# Altium project Internship_2.PrjPcb
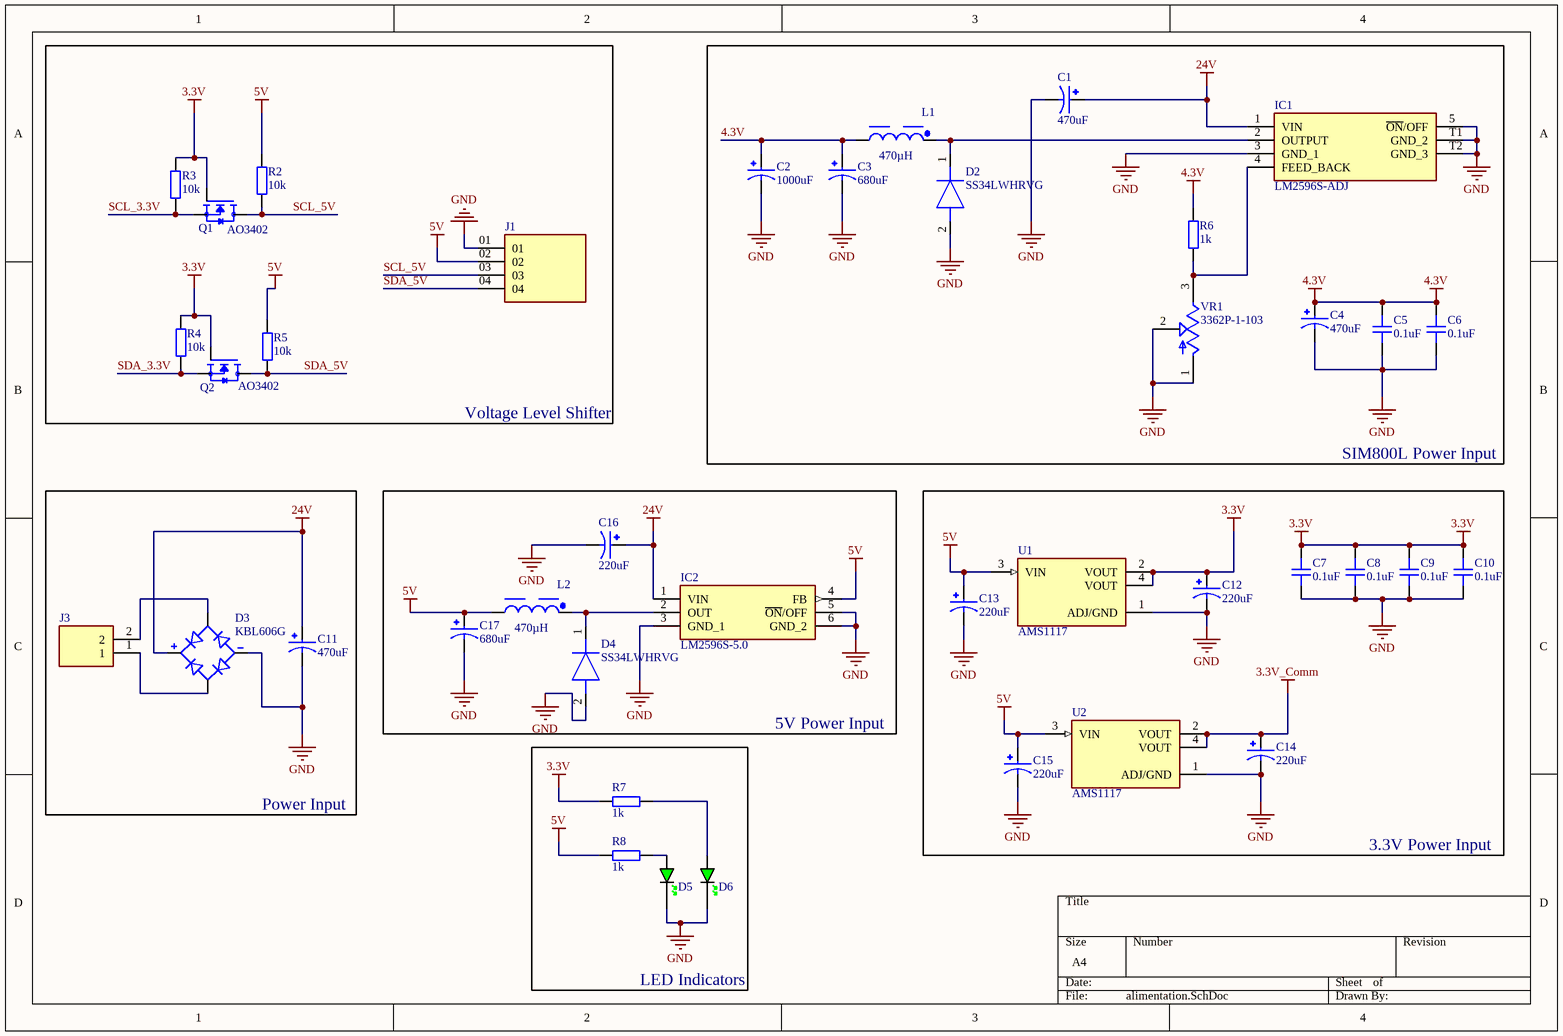
[diagram p0: alimentation.SchDoc]
2 sheets, 84 parts. Net scope: global (net labels, ports and power ports of the same name join across sheets).
Board file: PCB1.PcbDoc
Sheets:
  alimentation.SchDoc
  communication.SchDoc

## Sheet alimentation.SchDoc
size A4; SheetNumber: 1; SheetTotal: 2

### Parts
C1  470uF  [CAPPRD500W60D1000H1600]
C2  1000uF  [CAPPRD500W60D1000H2500]
C3  680uF  [CAPPRD500W60D1000H1600]
C4  470uF  [CAPPRD500W60D1000H1600]
C5  0.1uF  [CAP_0805]
C6  0.1uF  [CAP_0805]
C7  0.1uF  [CAP_0805]
C8  0.1uF  [CAP_0805]
C9  0.1uF  [CAP_0805]
C10  0.1uF  [CAP_0805]
C11  470uF  [CAPPRD500W60D1000H1600]
C12  220uF  [CAPPRD500W60D800H1150]
C13  220uF  [CAPPRD500W60D800H1150]
C14  220uF  [CAPPRD500W60D800H1150]
C15  220uF  [CAPPRD500W60D800H1150]
C16  220uF  [CAPPRD500W60D800H1150]
C17  680uF  [CAPPRD500W60D1000H1600]
D2  SS34LWHRVG  [SODFL3718X102N]
D3  KBL606G  [SIP600W130P510L1900H1630Q4]
D4  SS34LWHRVG  [SODFL3718X102N]
D5  GREEN  [LED_0805_GREEN]  (value not drawn)
D6  GREEN  [LED_0805_GREEN]  (value not drawn)
IC1  LM2596S-ADJ  [LM2596SXADJ]
IC2  LM2596S-5.0  [KTT0005B]
J1  MTSW-104-08-S-S-270  [SAMTEC_MTSW-104-08-S-S-270]  (value not drawn)
J3  TBP04R12-500-02BE  [CUI_TBP04R12-500-02BE]  (value not drawn)
L1  470µH  [WE-PD HV_1210]
L2  470µH  [WE-PD HV_1210]
Q1  AO3402  [SOT95P280X125-3N]
Q2  AO3402  [SOT95P280X125-3N]
R2  10k  [RES_1206]
R3  10k  [RES_1206]
R4  10k  [RES_1206]
R5  10k  [RES_1206]
R6  1k  [RES_1206]
R7  1k  [RES_1206]
R8  1k  [RES_1206]
U1  AMS1117  [SOT229P700X180-4N]
U2  AMS1117  [SOT229P700X180-4N]
VR1  3362P-1-103  [TRIM_3362P-1-103]

### Blocks framed on the sheet
Voltage Level Shifter: J1 Q1 Q2 R2-R5
SIM800L Power Input: C1-C6 D2 IC1 L1 R6 VR1
Power Input: C11 D3 J3
5V Power Input: C16 C17 D4 IC2 L2
3.3V Power Input: C7-C10 C12-C15 U1 U2
LED Indicators: D5 D6 R7 R8

### Nets
3.3V: C7.2 C8.2 C9.2 C10.2 C12.P Q1.1(G) Q2.1(G) R3.1 R4.1 R7.1 U1.2(VOUT) U1.4(VOUT)
3.3V_Comm: C14.P U2.2(VOUT) U2.4(VOUT)
4.3V: C2.P C3.P C4.P C5.2 C6.2 L1.2 R6.2
5V: C13.P C15.P C17.P IC2.4(FB) J1.02 L2.2 R2.1 R5.1 R8.1 U1.3(VIN) U2.3(VIN)
24V: C1.P C11.P C16.P D3.POS IC1.1(VIN) IC2.1(VIN)
GND: C1.N C2.N C3.N C4.N C5.1 C6.1 C7.1 C8.1 C9.1 C10.1 C11.N C12.N C13.N C14.N C15.N C16.N C17.N D2.2(A) D3.NEG D4.2(A) D5.K D6.K IC1.3(GND_1) IC1.5(~{ON}/OFF) IC1.T1(GND_2) IC1.T2(GND_3) IC2.3(GND_1) IC2.5(~{ON}/OFF) IC2.6(GND_2) J1.01 U1.1(ADJ/GND) U2.1(ADJ/GND) VR1.1(CCW) VR1.2(WIPER)
SCL_3.3V: Q1.2(S) R3.2
SCL_5V: J1.03 Q1.3(D) R2.2
SDA_3.3V: Q2.2(S) R4.2
SDA_5V: J1.04 Q2.3(D) R5.2
NetD2_1: D2.1(K) IC1.2(OUTPUT) L1.1
NetD3_AC1: D3.AC1 J3.2
NetD3_AC2: D3.AC2 J3.1
NetD4_1: D4.1(K) IC2.2(OUT) L2.1
NetD5_A: D5.A R8.2
NetD6_A: D6.A R7.2
NetIC1_4: IC1.4(FEED_BACK) R6.1 VR1.3(CW)

### Library data of the parts
C1 C3 C4 C11 C17 = EEUHD1V681B: CAP ALUM 680UF 20% 35V RADIAL; MF: Panasonic; MP: EEU-HD1V681B; Package: RADIAL-2 Panasonic; Price: None; Check_prices: https://www.snapeda.com/parts/EEU-HD1V681B/Panasonic/view-part/?ref=eda; Value: *; SnapEDA_Link: https://www.snapeda.com/parts/EEU-HD1V681B/Panasonic/view-part/?ref=snap; Availability: In Stock; Purchase-URL: https://pricing.snapeda.com/search?q=EEU-HD1V681B&ref=eda
C2 = EEUFS1V102L: 1000ÂµF 35V Aluminum Electrolytic Capacitors Radial, Can 10000 Hrs @ 105Â°C; MF: Panasonic; Package: RADIAL-2 Panasonic; SnapEDA_Link: https://www.snapeda.com/parts/EEUFS1V102L/Panasonic/view-part/?ref=snap; Value: *; MP: EEUFS1V102L; Check_prices: https://www.snapeda.com/parts/EEUFS1V102L/Panasonic/view-part/?ref=eda; Availability: In Stock; Purchase-URL: https://pricing.snapeda.com/search/part/EEUFS1V102L/?ref=eda; Price: None
C5-C10 = CAP_0805: Capacitor SMD 0805; Manufacturer: *; Manufacturer Part Number: *; Distributor Link: *; LCSC: *; Rating: *; Dielectric: *
C12-C16 = EEUHD1V221B: Cap Aluminum 220uF 35V 20% (8 X 11.5mm) Radial 5mm 270mA 1000 hr 105C Ammo Pack; MP: EEU-HD1V221B; MF: Panasonic; Package: RADIAL-2 Panasonic; Availability: In Stock; Value: *; SnapEDA_Link: https://www.snapeda.com/parts/EEU-HD1V221B/Panasonic/view-part/?ref=snap; Price: None; Check_prices: https://www.snapeda.com/parts/EEU-HD1V221B/Panasonic/view-part/?ref=eda; Purchase-URL: https://pricing.snapeda.com/search/part/EEU-HD1V221B/?ref=eda
D2 D4 = SS34LWHRVG: Diode; Manufacturer_Name: Taiwan Semiconductor; Datasheet Link: https://datasheet.datasheetarchive.com/originals/distributors/DKDS-20/389381.pdf; Height: 1.02mm; Manufacturer_Part_Number: SS34LWHRVG; Mouser Part Number: 821-SS34LWHRVG; Mouser Price/Stock: https://www.mouser.co.uk/ProductDetail/Taiwan-Semiconductor/SS34LWHRVG?qs=5aG0NVq1C4zYvYQjFNyRbA%3D%3D; Arrow Part Number: SS34LWHRVG; Arrow Price/Stock: https://www.arrow.com/en/products/ss34lwhrvg/taiwan-semiconductor?region=asia
D5 D6 = LED_0805_GREEN: LED 0805 GREEN SMD; Manufacturer: *; Manufacturer Part Number: *; Distributor Link: *; LCSC: *
IC1 = LM2596S-ADJ: Integrated Circuit; Manufacturer_Name: Texas Instruments; Datasheet Link: https://www.ti.com/lit/ds/symlink/lm2596.pdf?HQS=ti-null-null-sf-df-pf-sep-wwe&ts=1592978195629; Height: 4.57mm; Manufacturer_Part_Number: LM2596S-ADJ; Mouser Part Number: 926-LM2596S-ADJ; Mouser Price/Stock: https://www.mouser.co.uk/ProductDetail/Texas-Instruments/LM2596S-ADJ?qs=X1J7HmVL2ZGmRmhAtwKZ2Q%3D%3D
IC2 = LM2596S-5.0: Integrated Circuit; Manufacturer_Name: Texas Instruments; Datasheet Link: https://www.ti.com/lit/gpn/LM2596; Manufacturer_Part_Number: LM2596S-5.0; Mouser Part Number: 926-LM2596S-50; Mouser Price/Stock: https://www.mouser.co.uk/ProductDetail/Texas-Instruments/LM2596S-5.0?qs=X1J7HmVL2ZGcOr96VNr%252B%2Fw%3D%3D; Arrow Part Number: LM2596S-5.0; Arrow Price/Stock: https://www.arrow.com/en/products/lm2596s-5.0/texas-instruments?region=nac
J1 = MTSW-104-08-S-S-270: Connector Header Through Hole 4 position 0.100 (2.54mm); MF: Samtec; SnapEDA_Link: https://www.snapeda.com/parts/MTSW-104-08-S-S-270/Samtec/view-part/?ref=snap; Package: None; Value: *; MP: MTSW-104-08-S-S-270; Check_prices: https://www.snapeda.com/parts/MTSW-104-08-S-S-270/Samtec/view-part/?ref=eda
J3 = TBP04R12-500-02BE: 2~24 Poles, Pluggable, Receptacle, Horizontal, 5.0 Pitch, Terminal Block Connector; MF: Same Sky; SnapEDA_Link: https://www.snapeda.com/parts/TBP04R12-500-02BE/Same+Sky/view-part/?ref=snap; Package: None; Value: *; MP: TBP04R12-500-02BE; Check_prices: https://www.snapeda.com/parts/TBP04R12-500-02BE/Same+Sky/view-part/?ref=eda
L1 L2 = 7687709102: WE-PD HV High Voltage Power Inductor, SMT, size 1210, 1000µH, 0.72A, 1.4Ω; Manufacturer: Wurth Elektronik; Case/Size Code: 1210; DC Resistance: 1.2Ω; Operating Voltage (DC): 400V; Saturation Current: 0.9A; Self Resonant Frequency: 1.2MHz; Manufacturer Part Number: 7687709102; Category: Power Inductors; Match Code: WE-PD HV; ComponentLink1Description: Website Link; ComponentLink1URL: https://www.we-online.com/redexpert/article/7687709102?ad; ComponentLink2Description: Datasheet Link; ComponentLink2URL: https://www.we-online.com/redexpert/spec/7687709102?ad; Mount: Surface Mount; Min Operating Temperature: -40°C; Max Operating Temperature: 125°C; Packaging: Tape and Reel; Length: 12mm; Width: 12mm; Height: 10.5mm; DC Resistance Max: 1.4Ω; Inductance: 1000µH; Rated Current: 0.72A
Q1 Q2 = AO3402: N-Channel 30 V 4A (Ta) 1.4W (Ta) Surface Mount SOT-23-3; MF: Alpha & Omega Semiconductor; SnapEDA_Link: https://www.snapeda.com/parts/AO3402/Alpha/view-part/?ref=snap; Package: SOT-23 Alpha &amp; Omega Semiconductor; Value: *; MP: AO3402; Check_prices: https://www.snapeda.com/parts/AO3402/Alpha/view-part/?ref=eda
R2-R8 = RES_1206: Resistor SMD 1206; Manufacturer: *; Manufacturer Part Number: *; Distributor Link: *; LCSC: *
U1 U2 = AMS1117: 1A LOW DROPOUT VOLTAGE REGULATOR SOT-223; MF: Advanced Monolithic Systems; SnapEDA_Link: https://www.snapeda.com/parts/AMS1117/Advanced+Monolithic+Systems/view-part/?ref=snap; Package: SOT-223 Seeed Technology; Value: *; MP: AMS1117; Check_prices: https://www.snapeda.com/parts/AMS1117/Advanced+Monolithic+Systems/view-part/?ref=eda
VR1 = 3362P-1-103: TRIMMER - 1/4in SQ ST CERMET | Bourns 3362P-1-103; SnapEDA_Link: https://www.snapeda.com/parts/3362P-1-103/Bourns/view-part/?ref=snap; Package: 3362P-1 Bourns Inc.; Value: *; MF: Bourns; MP: 3362P-1-103; Check_prices: https://www.snapeda.com/parts/3362P-1-103/Bourns/view-part/?ref=eda
D3 = KBL606G: Value: *; MP: KBL606G; Availability: Unavailable; Price: None; Package: None

## Sheet communication.SchDoc
size A4; SheetNumber: 2; SheetTotal: 2
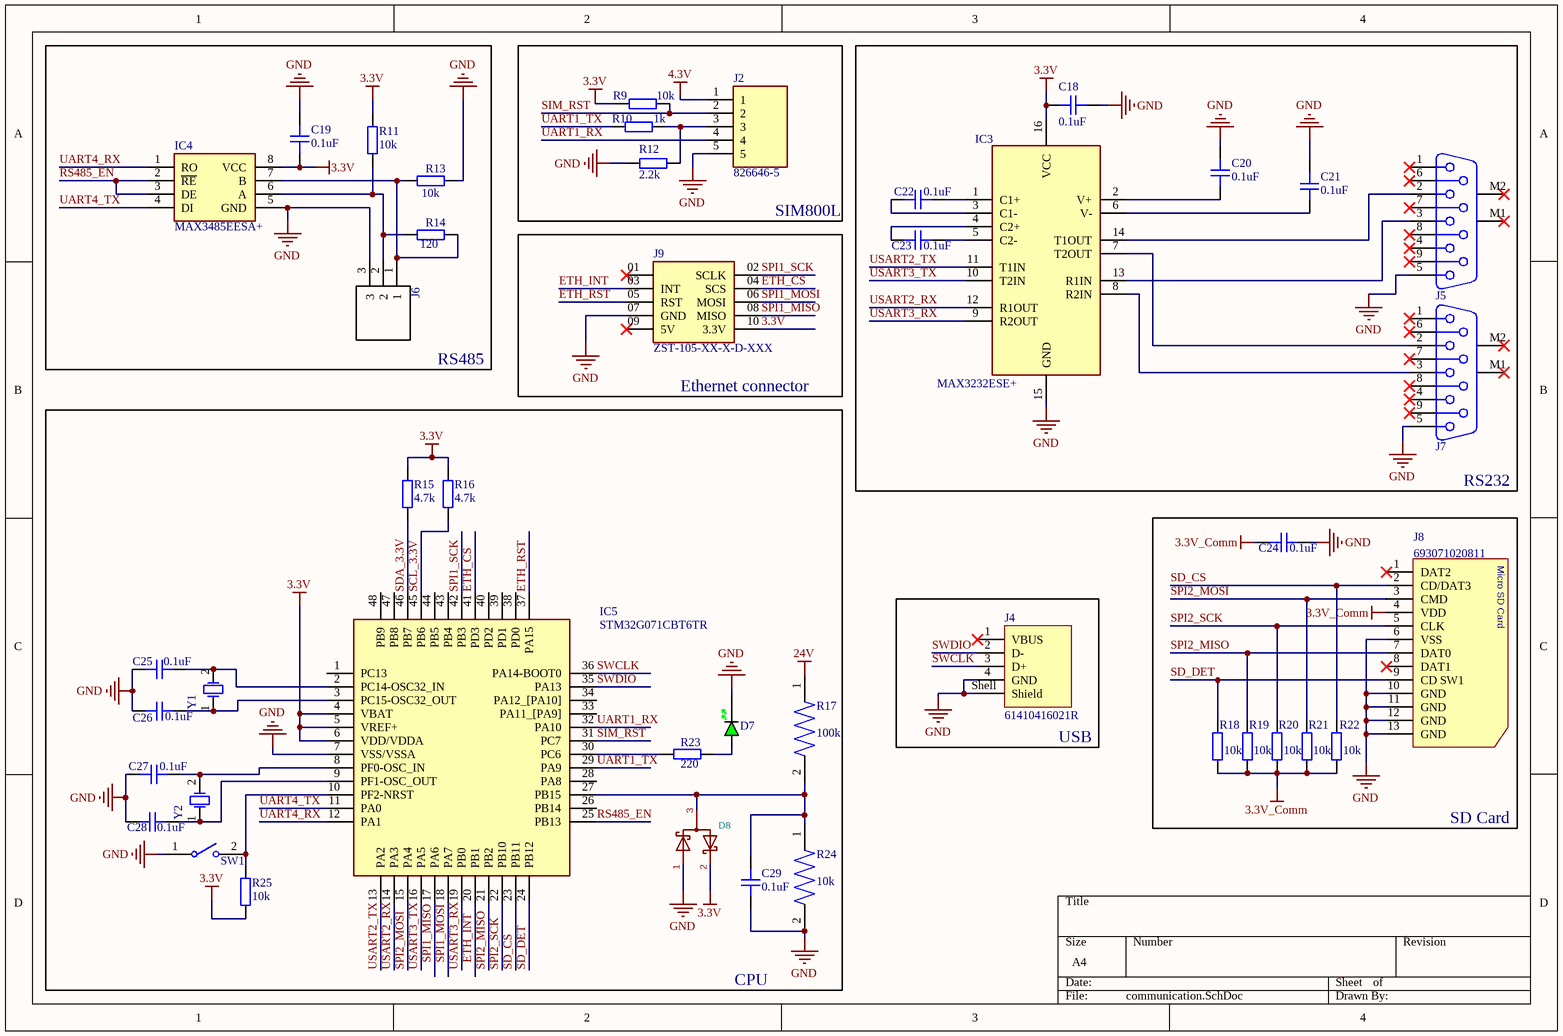
[diagram p1: communication.SchDoc]

### Parts
C18  0.1uF  [CAP_0805]
C19  0.1uF  [CAP_0805]
C20  0.1uF  [CAP_0805]
C21  0.1uF  [CAP_0805]
C22  0.1uF  [CAP_0805]
C23  0.1uF  [CAP_0805]
C24  0.1uF  [CAP_0805]
C25  0.1uF  [CAP_0805]
C26  0.1uF  [CAP_0805]
C27  0.1uF  [CAP_0805]
C28  0.1uF  [CAP_0805]
C29  0.1uF  [CAP_0805]
D7  GREEN  [LED_0805_GREEN]  (value not drawn)
D8  Schottky-Dual-Diode_Series  [SOT-23]  (value not drawn)
IC3  MAX3232ESE+  [SOIC127P600X175-16N]
IC4  MAX3485EESA+  [SOIC127P600X175-8N]
IC5  STM32G071CBT6TR  [QFP50P900X900X160-48N]
J2  826646-5  [TE_826646-5]
J4  61410416021R  [61410416021R]
J5  Female, Straight, 9p  [210611003]  (value not drawn)
J6  TBP04R1-500-03BE  [*CUI_TBP04R1-500-03BE]  (value not drawn)
J7  Female, Straight, 9p  [210611003]  (value not drawn)
J8  693071020811  [693071020811]
J9  ZST-105-XX-X-D-XXX  [SAMTEC_ZST-105-XX-X-D-XXX]
R9  10k  [RES_1206]
R10  1k  [RES_1206]
R11  10k  [RES_1206]
R12  2.2k  [RES_1206]
R13  10k  [RES_1206]
R14  120  [RES_1206]
R15  4.7k  [RES_1206]
R16  4.7k  [RES_1206]
R17  value 100k  [RESAD700W45L350D185]  (hidden comment: 3-1623927-1)
R18  10k  [RES_1206]
R19  10k  [RES_1206]
R20  10k  [RES_1206]
R21  10k  [RES_1206]
R22  10k  [RES_1206]
R23  220  [RES_1206]
R24  value 10k  [RESAD700W45L350D185]  (hidden comment: 3-1623927-1)
R25  10k  [RES_1206]
SW1  434121043816  [434121043816]  (value not drawn)
Y1  32.768kHz  [WE-XTAL_WATCH_D3H8.2]  (value not drawn)
Y2  10MHz  [WE-XTAL_HC49/4H]  (value not drawn)

### Blocks framed on the sheet
RS485: C19 IC4 J6 R11 R13 R14
SIM800L: J2 R9 R10 R12
RS232: C18 C20-C23 IC3 J5 J7
SD Card: C24 J8 R18-R22
USB: J4

### Nets
3.3V: C18.2 C19.1 D8.2(C) IC3.16(VCC) IC4.8(VCC) IC5.4(VBAT) IC5.5(VREF+) IC5.6(VDD/VDDA) J9.10(3.3V) R9.2 R11.1 R15.1 R16.1 R25.2
3.3V_Comm: C24.2 J8.4(VDD) R18.2 R19.2 R20.2 R21.2 R22.2
4.3V: J2.1
24V: R17.1
GND: C18.1 C19.2 C20.2 C21.1 C24.1 C25.2 C26.2 C27.2 C28.2 C29.1 D7.K D8.1(A) IC3.15(GND) IC4.5(GND) IC5.7(VSS/VSSA) J2.5 J4.4(GND) J4.Shell(Shield) J5.5 J6.3 J7.5 J8.6(VSS) J8.10(GND) J8.11(GND) J8.12(GND) J8.13(GND) J9.07(GND) R12.1 R13.1 R24.2 SW1.1
ETH_CS: IC5.41(PD3) J9.04(SCS)
ETH_INT: IC5.20(PB1) J9.03(INT)
ETH_RST: IC5.37(PA15) J9.05(RST)
RS485_EN: IC4.2(~{RE}) IC4.3(DE) IC5.25(PB13)
SCL_3.3V: IC5.45(PB6) R16.2
SD_CS: IC5.23(PB11) J8.2(CD/DAT3) R22.1
SD_DET: IC5.24(PB12) J8.9(CD_SW1) R18.1
SDA_3.3V: IC5.46(PB7) R15.2
SIM_RST: IC5.31(PC7) J2.2 R9.1
SPI1_MISO: IC5.17(PA6) J9.08(MISO)
SPI1_MOSI: IC5.18(PA7) J9.06(MOSI)
SPI1_SCK: IC5.42(PB3) J9.02(SCLK)
SPI2_MISO: IC5.21(PB2) J8.7(DAT0) R19.1
SPI2_MOSI: IC5.15(PA4) J8.3(CMD) R21.1
SPI2_SCK: IC5.22(PB10) J8.5(CLK) R20.1
SWCLK: IC5.36(PA14-BOOT0) J4.3(D+)
SWDIO: IC5.35(PA13) J4.2(D-)
UART1_RX: IC5.32(PA10) J2.4
UART1_TX: IC5.29(PA9) R10.1
UART4_RX: IC4.1(RO) IC5.12(PA1)
UART4_TX: IC4.4(DI) IC5.11(PA0)
USART2_RX: IC3.12(R1OUT) IC5.14(PA3)
USART2_TX: IC3.11(T1IN) IC5.13(PA2)
USART3_RX: IC3.9(R2OUT) IC5.19(PB0)
USART3_TX: IC3.10(T2IN) IC5.16(PA5)
NetC20_1: C20.1 IC3.2(V+)
NetC21_2: C21.2 IC3.6(V-)
NetC22_1: C22.1 IC3.3(C1-)
NetC22_2: C22.2 IC3.1(C1+)
NetC23_1: C23.1 IC3.5(C2-)
NetC23_2: C23.2 IC3.4(C2+)
NetC25_1: C25.1 IC5.2(PC14-OSC32_IN) Y1.2(OSC2)
NetC26_1: C26.1 IC5.3(PC15-OSC32_OUT) Y1.1(OSC1)
NetC27_1: C27.1 IC5.8(PF0-OSC_IN) Y2.2(OSC2)
NetC28_1: C28.1 IC5.9(PF1-OSC_OUT) Y2.1(OSC1)
NetC29_2: C29.2 D8.3 IC5.27(PB15) R17.2 R24.1
NetD7_A: D7.A R23.1
NetIC3_7: IC3.7(T2OUT) J7.2
NetIC3_8: IC3.8(R2IN) J7.3
NetIC3_13: IC3.13(R1IN) J5.3
NetIC3_14: IC3.14(T1OUT) J5.2
NetIC4_6: IC4.6(A) J6.2 R11.2 R14.2
NetIC4_7: IC4.7(B) J6.1 R13.2 R14.1
NetIC5_10: IC5.10(PF2-NRST) R25.1 SW1.2
NetIC5_30: IC5.30(PC6) R23.2
NetJ2_3: J2.3 R10.2 R12.2

Not connected (* = marked no-connect by the designer): IC5 1(PC13) 26(PB14) 28(PA8) 33(PA11_[PA9]) 34(PA12_[PA10]) 38(PD0) 39(PD1) 40(PD2) 43(PB4) 44(PB5) 47(PB8) 48(PB9); J4 1(VBUS)*; J5 1* 4* 6* 7* 8* 9* M1* M2*; J7 1* 4* 6* 7* 8* 9* M1* M2*; J8 1(DAT2)* 8(DAT1)*; J9 01* 09(5V)*

### Notes on the sheet
- (near J9) Ethernet connector
- CPU

### Library data of the parts
C18-C29 = CAP_0805: Capacitor SMD 0805; Manufacturer: *; Manufacturer Part Number: *; Distributor Link: *; LCSC: *; Rating: *; Dielectric: *
D7 = LED_0805_GREEN: LED 0805 GREEN SMD; Manufacturer: *; Manufacturer Part Number: *; Distributor Link: *; LCSC: *
D8 = Schottky-Dual-Diode_Series: ki_keywords: Dual Schottky Diode Series; ki_description: Dual Schottky Diode in Series; Reference: D; Datasheet: https://diotec.com/request/datasheet/bat54.pdf; Value: Schottky-Dual-Diode
IC3 = MAX3232ESE+: Integrated Circuit; Manufacturer_Name: Analog Devices; Datasheet Link: https://www.mouser.com/datasheet/2/256/MAX3222-MAX3241-1292123.pdf; Height: 1.75mm; Manufacturer_Part_Number: MAX3232ESE+; Mouser Part Number: 700-MAX3232ESE; Mouser Price/Stock: https://www.mouser.co.uk/ProductDetail/Analog-Devices-Maxim-Integrated/MAX3232ESE%2b?qs=1THa7WoU59GfcUr9ieNstA%3D%3D; Arrow Part Number: MAX3232ESE+; Arrow Price/Stock: https://www.arrow.com/en/products/max3232ese/analog-devices?region=asia
IC4 = MAX3485EESA+: Integrated Circuit; Manufacturer_Name: Analog Devices; Datasheet Link: https://datasheet.datasheetarchive.com/originals/distributors/Datasheets-18/DSA-341145.pdf; Height: 1.75mm; Manufacturer_Part_Number: MAX3485EESA+; Mouser Part Number: 700-MAX3485EESA; Mouser Price/Stock: https://www.mouser.co.uk/ProductDetail/Analog-Devices-Maxim-Integrated/MAX3485EESA%2b?qs=1THa7WoU59HLsdsozrMCeQ%3D%3D; Arrow Part Number: MAX3485EESA+; Arrow Price/Stock: https://www.arrow.com/en/products/max3485eesa/analog-devices?utm_currency=USD&region=nac
IC5 = STM32G071CBT6TR: Integrated Circuit; Manufacturer_Name: STMicroelectronics; Datasheet Link: https://www.st.com/resource/en/datasheet/stm32g071cb.pdf; Height: 1.6mm; Manufacturer_Part_Number: STM32G071CBT6TR; Mouser Part Number: 511-STM32G071CBT6TR; Mouser Price/Stock: https://www.mouser.co.uk/ProductDetail/STMicroelectronics/STM32G071CBT6TR?qs=l7cgNqFNU1gody9j5I9dSQ%3D%3D; Arrow Part Number: STM32G071CBT6TR; Arrow Price/Stock: https://www.arrow.com/en/products/stm32g071cbt6tr/stmicroelectronics?region=nac
J2 = 826646-5: Board-To-Board Connector, Through Hole, Header, 5, 2.54 mm, Gold Plated Contacts; MF: TE Connectivity; SnapEDA_Link: https://www.snapeda.com/parts/826646-5/TE+Connectivity+AMP+Connectors/view-part/?ref=snap; Package: None; Value: *; MP: 826646-5; EU_RoHS_Compliance: Compliant; Check_prices: https://www.snapeda.com/parts/826646-5/TE+Connectivity+AMP+Connectors/view-part/?ref=eda
J4 = 61410416021R: WR-COM USB 2.0 Type A Horizontal THR; Manufacturer: Wurth Elektronik; Match Code: WR-USB; Gender: Receptacle; Interface Type: Type A; Number of Ports: 1; Rated Current: 1.5A; Working Voltage: 30V (AC); Manufacturer Part Number: 61410416021R; Category: Input/Output Connectors; ComponentLink1Description: Website Link; ComponentLink1URL: https://www.we-online.com/redexpert/article/61410416021R?ad; ComponentLink2Description: Datasheet Link; ComponentLink2URL: https://www.we-online.com/redexpert/spec/61410416021R?ad; Mount: Surface Mount; Min Operating Temperature: -55°C; Max Operating Temperature: 85°C; Packaging: Tape and Reel; Application: USB 2.0; Number of Pins: 4; Orientation: Horizontal
J5 J7 = 210611003: WE-D-SUB Filter Connector, THT, Straight, Female, 9p; Manufacturer: Wurth Elektronik; Insulation Resistance min.: 1000MOhm; Pin Number: 9; Rated Voltage: 100VDC; Rated Current: 5A; Withstand Voltage: 250Vrms; ComponentLink1Description: Manufacturer; ComponentLink1URL: http://www.we-online.de; ComponentLink2Description: Datasheet; Gender: Female; ComponentLink2URL: https://www.we-online.com/catalog/datasheet/210611003.pdf; Mounting Technology: THT; Packaging: Tray; Orientation: Straight; Operating Temperature: -55 to +125degC; Manufacturer Part Number: 210611003; Published Date: April 2020
J8 = 693071020811: WR-CRD SD Card Connector Push & Push Socket, 8 pins; Manufacturer: Wurth Elektronik; Durability: 10000 Mating cycles; Manufacturer Part Number: 693071020811; Category: Input/Output Connector; Match Code: WR-CRD; ComponentLink1Description: Website Link; ComponentLink1URL: https://www.we-online.com/redexpert/article/693071020811?ad; ComponentLink2Description: Datasheet Link; ComponentLink2URL: https://www.we-online.com/redexpert/spec/693071020811?ad; Mount: Surface Mount; Min Operating Temperature: -40 °C; Max Operating Temperature: 85 °C; Packaging: Tape and Reel; Application: Micro SD Card; Gender: Socket; Number of Pins: 8; Type: Push & Push
J9 = ZST-105-XX-X-D-XXX: HEADER, 10 CONTACTS, 2 ROWS, THROUGH HOLE, 2.54 MM; Connector Systems:Wire-to-Board; Pitch Spacing:2.54mm; No. of Rows:2Rows; No. of Contacts:10Contacts; Contact Termination Type:Through Hole; Product Range:Flex Stack ZST Series RoHS Compliant: Yes; MF: Samtec; MP: ZST10501FD450; SnapEDA_Link: https://www.snapeda.com/parts/ZST10501FD450/Samtec/view-part/?ref=snap; Package: None; Value: *; Check_prices: https://www.snapeda.com/parts/ZST10501FD450/Samtec/view-part/?ref=eda
R9-R16 R18-R23 R25 = RES_1206: Resistor SMD 1206; Manufacturer: *; Manufacturer Part Number: *; Distributor Link: *; LCSC: *
R17 R24 = 3-1623927-1: 1 MOhms Â±5% 1W, 1/4W Through Hole Resistor Axial - Carbon Film; MF: TE Connectivity; Price: None; SnapEDA_Link: https://www.snapeda.com/parts/3-1623927-1/TE+Connectivity/view-part/?ref=snap; Check_prices: https://www.snapeda.com/parts/3-1623927-1/TE+Connectivity/view-part/?ref=eda; MP: 3-1623927-1; Package: None; Availability: In Stock
SW1 = 434121043816: WS-TASV SMT Tact Switch, 6mm x 3.5mm x 4.3mm, SPST-NO, 160gf, 12V, 50mA; Manufacturer: Wurth Elektronik; Washable: No; Manufacturer Part Number: 434121043816; Category: Tact Switch; Match Code: WS-TASV; ComponentLink1Description: Website Link; ComponentLink1URL: https://www.we-online.com/redexpert/article/434121043816?ad; ComponentLink2Description: Datasheet Link; ComponentLink2URL: https://www.we-online.com/redexpert/spec/434121043816?ad; Mount: Surface Mount; Min Operating Temperature: -40°C; Max Operating Temperature: 85°C; Packaging: Tape and Reel; Length: 6mm; Width: 3.5mm; Height: 4.3mm; Rated Current: 50mA; Circuit: SPST-NO; Contact Material: Stainless Steel; Contact Plating: Silver; Operation Force: 160gf; Rated Voltage (DC): 12V; Terminal Material: Copper Alloy; Terminal Plating: Silver
Y1 = 830002995B: WE-XTAL Watch Crystal, WATCH, 32.768kHz, +/-20ppm; Manufacturer: Wurth Elektronik; Load Capacitance: 12.5pF; Manufacturer Part Number: 830002995B; Category: Crystals; Match Code: WE-XTAL; ComponentLink1Description: Website Link; ComponentLink1URL: https://www.we-online.com/redexpert/article/830002995B?ad; ComponentLink2Description: Datasheet Link; ComponentLink2URL: https://www.we-online.com/redexpert/spec/830002995B?ad; Mount: Through Hole; Min Operating Temperature: -40°C; Max Operating Temperature: 85°C; Packaging: Bulk; Case/Size Code: WATCH; Height: 8.2mm; Diameter: 3mm; Application: Real Time Clock; Frequency: 32.768kHz; Frequency Tolerance: +/-20ppm
Y2 = 830003169B: WE-XTAL Quartz Crystal, HC49/4H, 10MHz, +/-30ppm; Manufacturer: Wurth Elektronik; Frequency Stability: 50ppm; Load Capacitance: 30pF; Manufacturer Part Number: 830003169B; Category: Crystals; Match Code: WE-XTAL; ComponentLink1Description: Website Link; ComponentLink1URL: https://www.we-online.com/redexpert/article/830003169B?ad; ComponentLink2Description: Datasheet Link; ComponentLink2URL: https://www.we-online.com/redexpert/spec/830003169B?ad; Mount: Through Hole; Min Operating Temperature: -20°C; Max Operating Temperature: 70°C; Packaging: Bulk; Case/Size Code: HC49/4H; Length: 11.35mm; Width: 4.85mm; Height: 4mm; Application: Processor, Ethernet; Frequency: 10MHz; Frequency Tolerance: +/-30ppm
J6 = TBP04R1-500-03BE: SnapEDA_Link: https://www.snapeda.com/parts/TBP04R1-500-03BE/Same+Sky/view-part/?ref=snap; Check_prices: https://www.snapeda.com/parts/TBP04R1-500-03BE/Same+Sky/view-part/?ref=eda; Value: *

## Nets that join several sheets
3.3V: alimentation (12 pins), communication (14 pins)
3.3V_Comm: alimentation (C14.P U2.2 U2.4), communication (7 pins)
4.3V: alimentation (7 pins), communication (J2.1)
24V: alimentation (6 pins), communication (R17.1)
GND: alimentation (34 pins), communication (31 pins)
SCL_3.3V: alimentation (Q1.2 R3.2), communication (IC5.45 R16.2)
SDA_3.3V: alimentation (Q2.2 R4.2), communication (IC5.46 R15.2)